# EasyEDA schematic LcsNodes-Building-Block-LCS-Bus-DCC-Signals-5.json
TITLE: LCS Bus - DCC Signal Input; REV: 1.1; Date: 2023-09-17; Sheet: 1/1; Drawn By: helmut-f; Company: Your Company
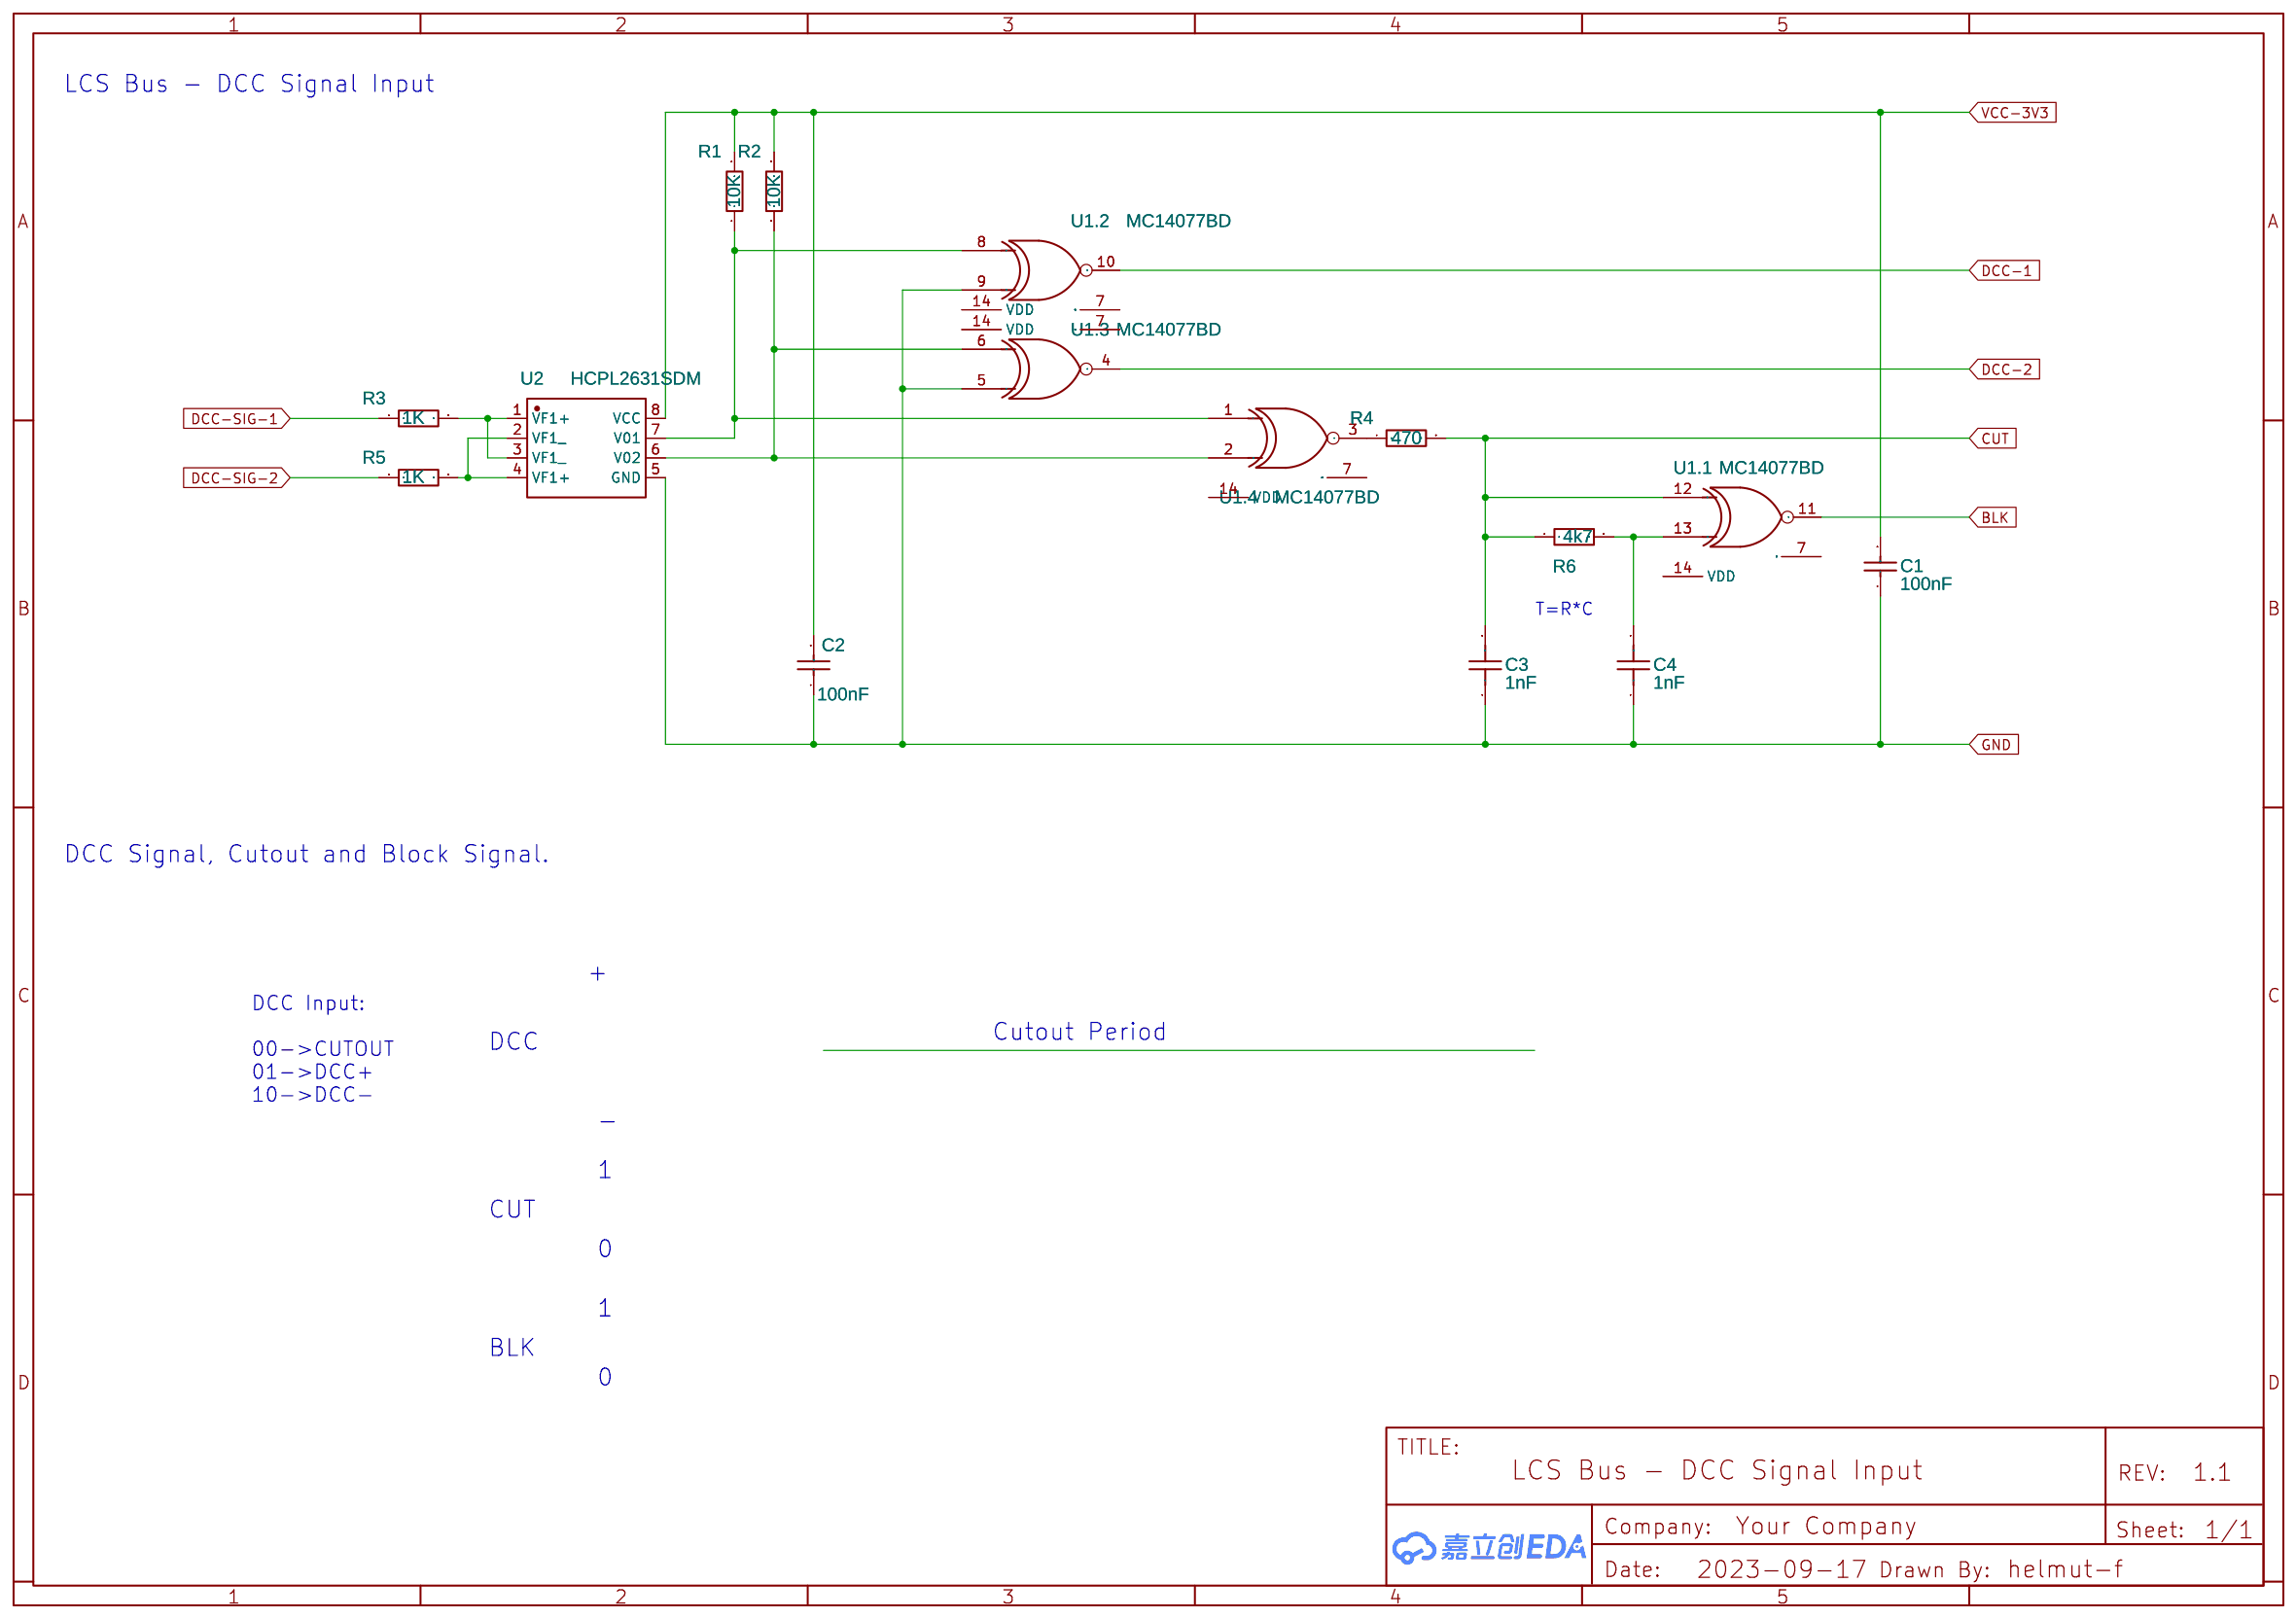
[diagram p0: schematic sheet]

## Parts
C1  100nF  [C1206]
C2  100nF  [C1206]
C3  1nF  [C1206]
C4  1nF  [C1206]
R1  10K  [R1206]
R2  10K  [R1206]
R3  1K  [R1206]
R4  470  [R1206]
R5  1K  [R1206]
R6  4k7  [R1206]
U1  MC14077BD  [SOIC14N]  (sections 1,2,3,4)
U2  HCPL2631SDM  [SMT-8_L9.7-W6.6-P2.54-LS10.3-TR]

## Library data of the parts
C1 C2 = CC1206KKX7R0BB104: Supplier: LCSC; Manufacturer: YAGEO(国巨); Supplier Part: C107181; JLCPCB Part Class: Extended Part; link: https://lcsc.com/eda_search?q=C107181&%26type=1&ref=editor
C3 C4 = CC1206JRNPO9BN102: Contributor: LCSC; Supplier: LCSC; Supplier Part: C113881; Manufacturer: YAGEO(国巨); JLCPCB Part Class: Extended Part; link: https://lcsc.com/eda_search?q=C113881&%26type=1&ref=editor
R1-R3 R5 = SR1206JR-7W4K7L: Contributor: LCSC; Supplier: LCSC; Supplier Part: C326768; Manufacturer: YAGEO(国巨); JLCPCB Part Class: Extended Part; link: https://lcsc.com/eda_search?q=C326768&%26type=1&ref=editor
R4 R6 = 1206W4F1001T5E: Supplier: LCSC; Manufacturer: UNI-ROYAL(厚声); Supplier Part: C4410; JLCPCB Part Class: Basic Part; link: https://lcsc.com/eda_search?q=C4410&%26type=1&ref=editor
U1 = MC14077BD: Quad XNOR Gate; subpart_no: 1
U2 = HCPL2631SDM: Contributor: LCSC; Supplier: LCSC; Supplier Part: C899529; Manufacturer: onsemi(安森美); JLCPCB Part Class: Extended Part

## Nets
GND: C1.1 C2.1 C3.1 C4.1 U1.5(A) U1.9(B) U2.5(GND)
VCC-3V3: C1.2 C2.2 R1.2 R2.2 U2.8(VCC)
BLK: U1.11(Y)
CUT: C3.2 R4.2 R6.1 U1.12(A)
DCC-1: U1.10(Y)
DCC-2: U1.4(Y)
DCC-SIG-1: R3.1
DCC-SIG-2: R5.1
Net-(C4-2): C4.2 R6.2 U1.13(B)
Net-(R1-1): R1.1 U1.1(A) U1.8(A) U2.7(V01)
Net-(R2-1): R2.1 U1.2(B) U1.6(B) U2.6(V02)
Net-(R3-2): R3.2 U2.1(VF1+) U2.3(VF1_)
Net-(R4-1): R4.1 U1.3(Y)
Net-(R5-2): R5.2 U2.2(VF1_) U2.4(VF1+)

Not connected (* = marked no-connect by the designer): U1 7(GND) 14(VDD)

## Notes on the sheet
- LCS Bus - DCC Signal Input
- T=R*C
- DCC Signal, Cutout and Block Signal.
- +
- DCC Input:
  00->CUTOUT
  01->DCC+
  10->DCC-
- Cutout Period
- DCC
- -
- 1
- CUT
- 0
- 1
- BLK
- 0
